# EAGLE schematic gpscircuit (EAGLE 7.5.0)
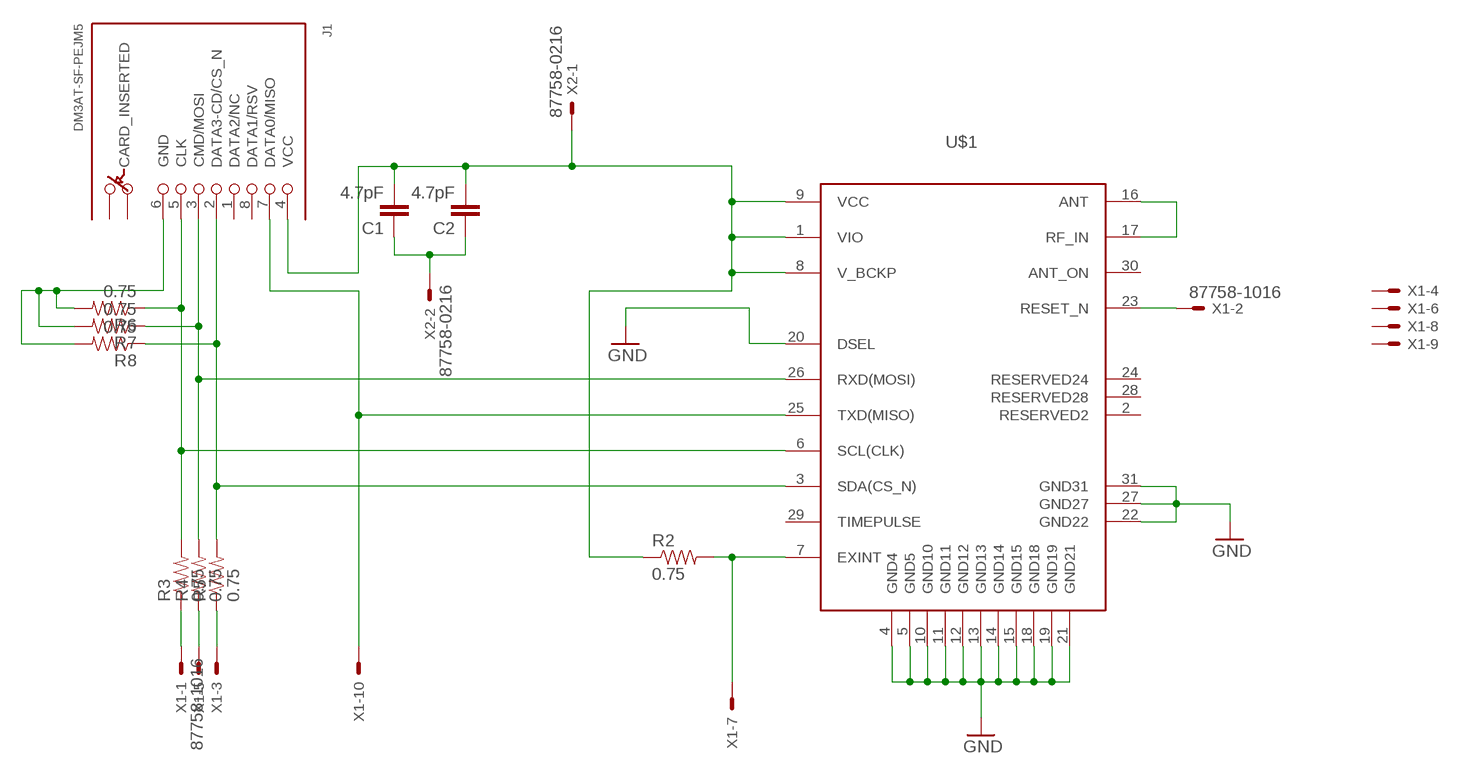
[diagram p0: schematic, sheet 1]

## Parts
C1  4.7pF  4.7PF-50V(-/+.25PF)(0603)  [0603-CAP]
C2  4.7pF  4.7PF-50V(-/+.25PF)(0603)  [0603-CAP]
J1  DM3AT-SF-PEJM5  [DM3AT-SF-PEJM5]
R2  0.75  0.75OHM-1/4W-1%(0805)  [0805]
R3  0.75  0.75OHM-1/4W-1%(0805)  [0805]
R4  0.75  0.75OHM-1/4W-1%(0805)  [0805]
R5  0.75  0.75OHM-1/4W-1%(0805)  [0805]
R6  0.75  0.75OHM-1/4W-1%(0805)  [0805]
R7  0.75  0.75OHM-1/4W-1%(0805)  [0805]
R8  0.75  0.75OHM-1/4W-1%(0805)  [0805]
U$1  CAM-M8Q  [CAM-M8Q]
X1  87758-1016  [87758-1016]
X2  87758-0216  [87758-0216]

## Nets
3.3V: C1.2 C2.2 J1.4(VCC) R2.1 U$1.1(VIO) U$1.8(V_BCKP) U$1.9(VCC) X2.1
GND: C1.1 C2.1 U$1.4(GND4) U$1.5(GND5) U$1.10(GND10) U$1.11(GND11) U$1.12(GND12) U$1.13(GND13) U$1.14(GND14) U$1.15(GND15) U$1.18(GND18) U$1.19(GND19) U$1.20(DSEL) U$1.21(GND21) U$1.22(GND22) U$1.27(GND27) U$1.31(GND31) X2.2
N$1: U$1.16(ANT) U$1.17(RF_IN)
N$2: U$1.23(RESET_N) X1.2
N$3: R2.2 U$1.7(EXINT)
N$4: J1.7(DATA0/MISO) U$1.25(TXD(MISO)) X1.10
N$5: R4.1 X1.5
N$6: R5.1 X1.3
N$7: J1.6(GND) R6.2 R7.2 R8.2
N$8: R3.1 X1.1
N$12: J1.5(CLK) R3.2 R6.1 U$1.6(SCL(CLK))
N$14: J1.2(DATA3-CD/CS_N) R5.2 R8.1 U$1.3(SDA(CS_N))
N$16: J1.3(CMD/MOSI) R4.2 R7.1 U$1.26(RXD(MOSI))
Unconnected: J1.1(DATA2/NC) J1.8(DATA1/RSV) J1.A J1.B U$1.2(RESERVED2) U$1.24(RESERVED24) U$1.28(RESERVED28) U$1.29(TIMEPULSE) U$1.30(ANT_ON) X1.4 X1.6 X1.7 X1.8 X1.9

## Library data of the parts
C1 C2 = SparkFun-Capacitors:4.7PF-50V(-/+.25PF)(0603): CAP-07880; PROD_ID: CAP-07880
J1 = connector:DM3AT-SF-PEJM5: CONN MICRO SD R/A PUSH-PUSH SMD; DIGIKEY: HR1964CT-ND
R2-R8 = SparkFun-Resistors:0.75OHM-1/4W-1%(0805): RES-08474; PROD_ID: RES-08474
U$1 = elements:CAM-M8Q: CAM‑M8 The CAM‑M8 modules are standalone GNSS antenna modules featuring the high performance u-blox M8 concurrent GNSS engine with reception of GPS, GLONASS, BeiDou and QZSS signals. Available in an industry standard form factor in leadless chip carrier (LCC) packages, it is easy to integrate and combines exceptional positioning performance with highly flexible power, design, and connectivity options. SMT pads allow fully automated assembly with standard pick & place and reflow-soldering equipment for cost-efficient, high-volume production enabling short time-to-market. datasheet: https://www.u-blox.com/sites/default/files/CAM-M8Q_DataSheet_%28UBX-13004081%29.pdf hw guide: https://www.u-blox.com/sites/default/files/CAM-M8_HardwareIntegrationManual_%28UBX-14000014%29.pdf
X1 = con-molex:87758-1016: 10 Pin - 2mm Dual Row Single Wafer, Vertical T/H HDR Source: http://www.molex.com/pdm_docs/sd/877580616_sd.pdf; MF: MOLEX; MPN: 87758-1016; OC_FARNELL: 7472340; OC_NEWARK: 59J1558
X2 = con-molex:87758-0216: 2 Pin - 2mm Dual Row Single Wafer, Vertical T/H HDR Source: http://www.molex.com/pdm_docs/sd/877580616_sd.pdf; MPN: 87758-0216; OC_FARNELL: unknown; OC_NEWARK: 94M1513